# EAGLE schematic Water-Quality-IoT-RealTime-Sch (EAGLE 9.7.0)

## Sheet 1 of 2
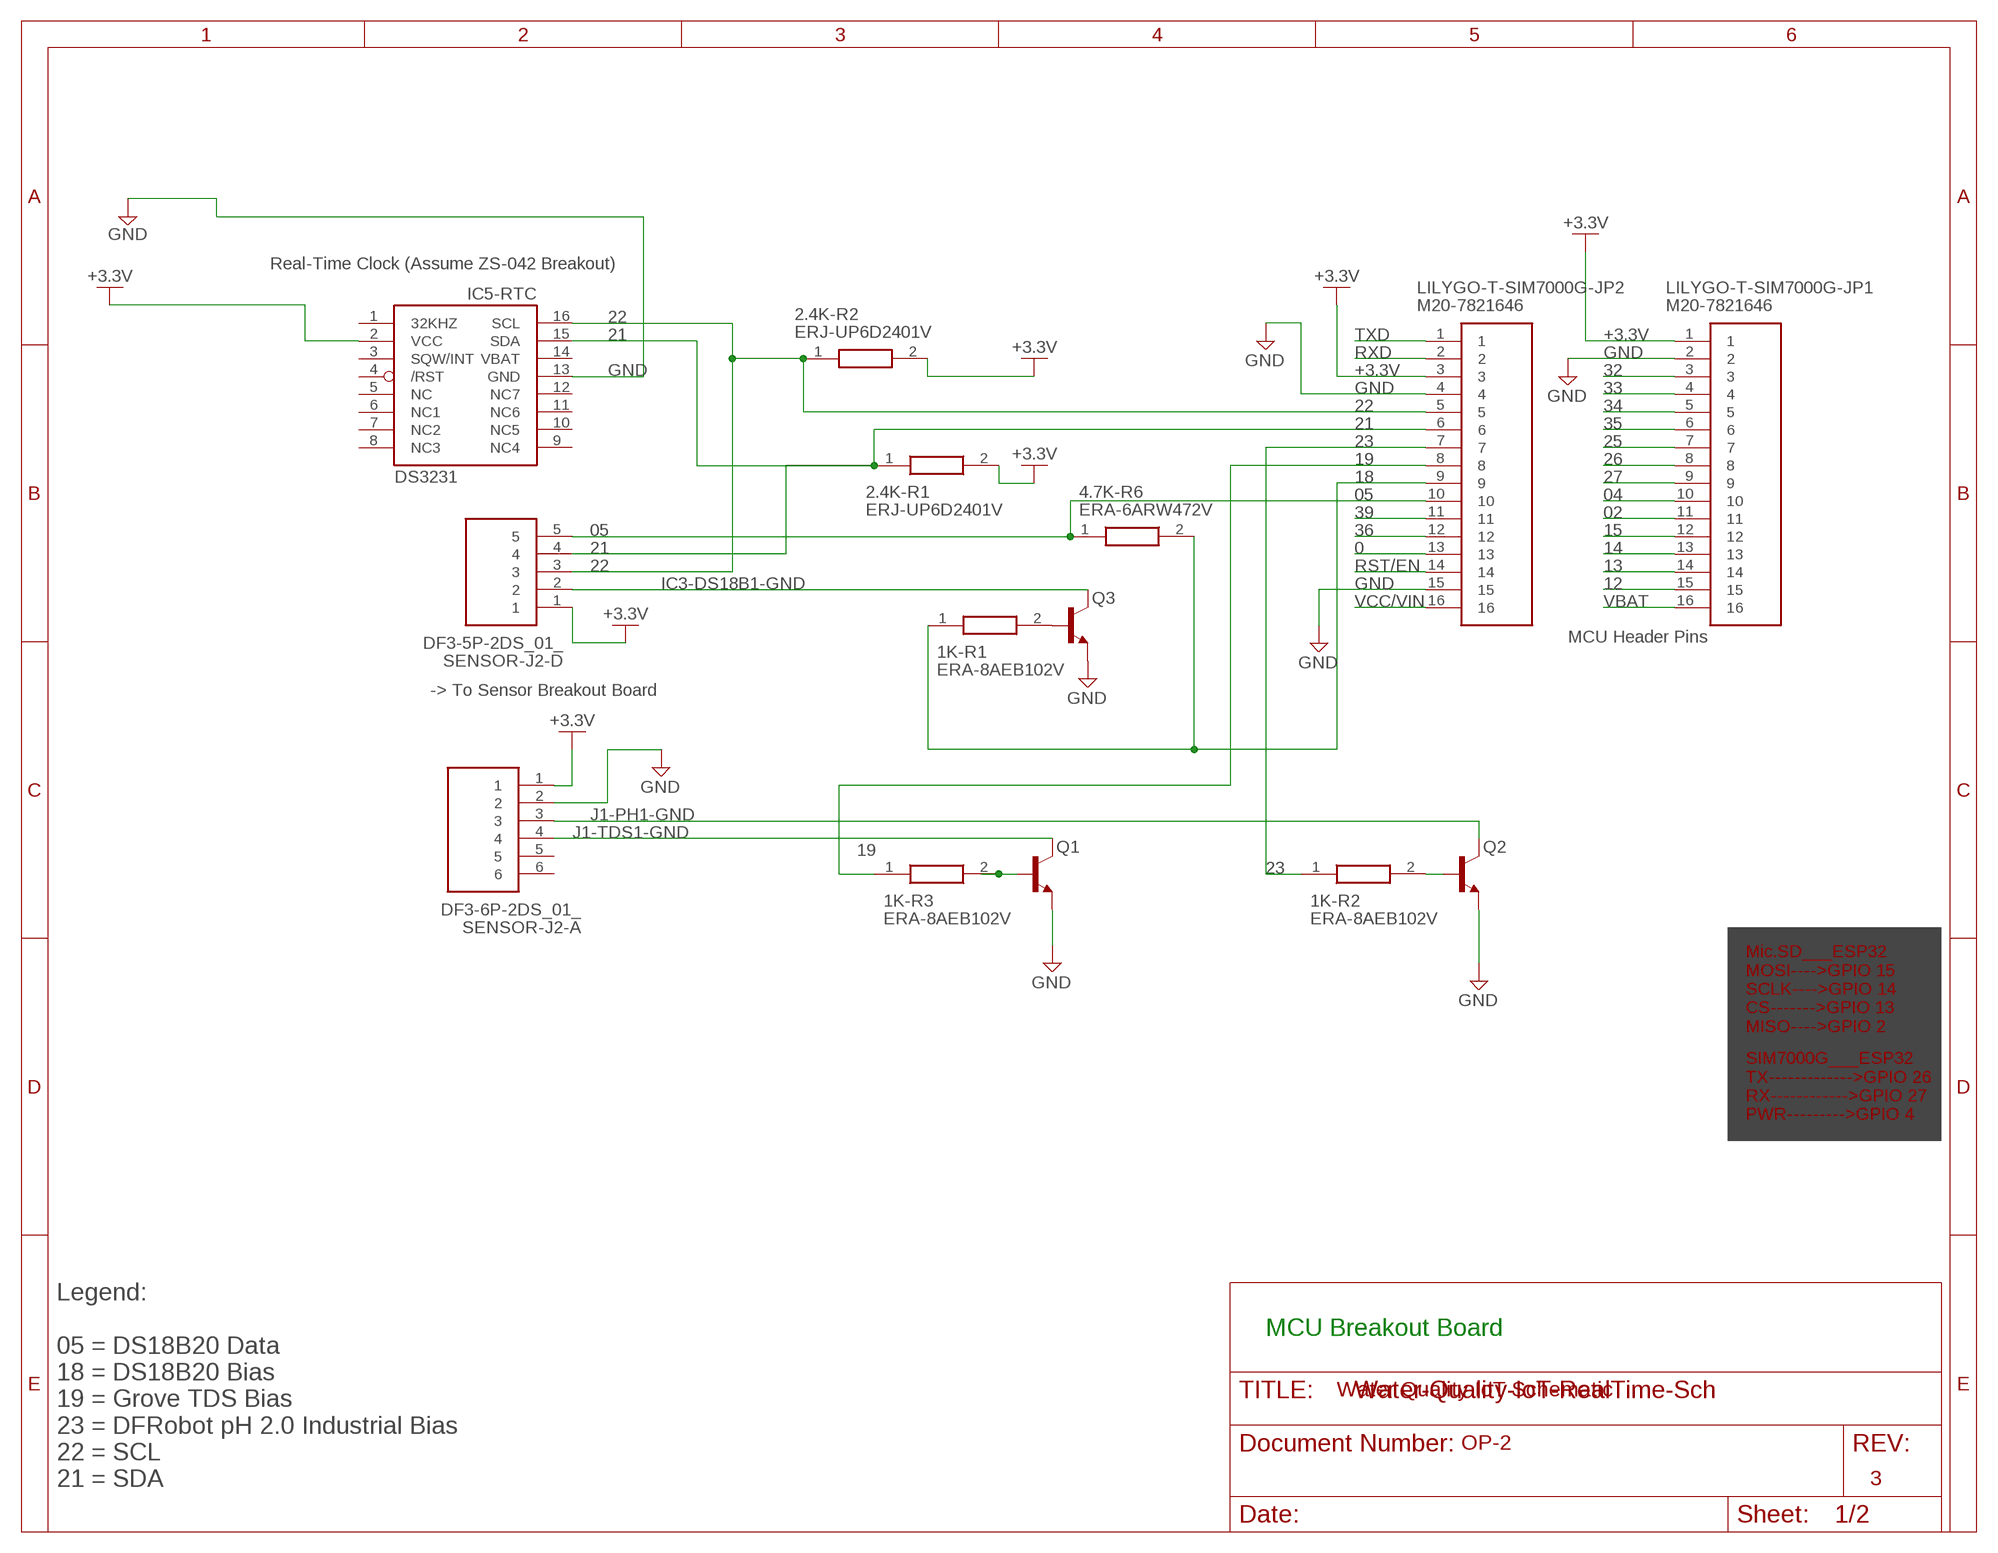
[diagram p0: schematic, sheet 1]

### Parts
1K-R1  ERA-8AEB102V  [RESC3216X70N]
1K-R2  ERA-8AEB102V  [RESC3216X70N]
1K-R3  ERA-8AEB102V  [RESC3216X70N]
2.4K-R1  ERJ-UP6D2401V  [ERJUP6]
2.4K-R2  ERJ-UP6D2401V  [ERJUP6]
4.7K-R6  ERA-6ARW472V  [ERA6AEB101V]
IC5-RTC  DS3231/SO  [SO16W]
LILYGO-T-SIM7000G-JP1  M20-7821646  [RHDR16W70P0X254_1X16_4104X250X]
LILYGO-T-SIM7000G-JP2  M20-7821646  [RHDR16W70P0X254_1X16_4104X250X]
Q1  BC547  NPN_BC547_TO92-CBE  [TO92]
Q2  BC547  NPN_BC547_TO92-CBE  [TO92]
Q3  BC547  NPN_BC547_TO92-CBE  [TO92]
SENSOR-J2-A  DF3-6P-2DS_01_  [DF36P2DS01]
SENSOR-J2-D  DF3-5P-2DS_01_  [SHDR5W60P0X200_1X5_1200X720X53]

### Nets
0: LILYGO-T-SIM7000G-JP2.13
02: LILYGO-T-SIM7000G-JP1.11
04: LILYGO-T-SIM7000G-JP1.10
05: 4.7K-R6.1 LILYGO-T-SIM7000G-JP2.10 SENSOR-J2-D.5 ; also sheet 2
12: LILYGO-T-SIM7000G-JP1.15
13: LILYGO-T-SIM7000G-JP1.14
14: LILYGO-T-SIM7000G-JP1.13
15: LILYGO-T-SIM7000G-JP1.12
18: 1K-R1.1 4.7K-R6.2 LILYGO-T-SIM7000G-JP2.9
19: 1K-R3.1 LILYGO-T-SIM7000G-JP2.8
21: 2.4K-R1.1 IC5-RTC.15(SDA) LILYGO-T-SIM7000G-JP2.6 SENSOR-J2-D.4 ; also sheet 2
22: 2.4K-R2.1 IC5-RTC.16(SCL) LILYGO-T-SIM7000G-JP2.5 SENSOR-J2-D.3 ; also sheet 2
23: 1K-R2.1 LILYGO-T-SIM7000G-JP2.7
25: LILYGO-T-SIM7000G-JP1.7
26: LILYGO-T-SIM7000G-JP1.8
27: LILYGO-T-SIM7000G-JP1.9
32: LILYGO-T-SIM7000G-JP1.3
33: LILYGO-T-SIM7000G-JP1.4
34: LILYGO-T-SIM7000G-JP1.5
35: LILYGO-T-SIM7000G-JP1.6
36: LILYGO-T-SIM7000G-JP2.12
39: LILYGO-T-SIM7000G-JP2.11
+3.3V: 2.4K-R1.2 2.4K-R2.2 LILYGO-T-SIM7000G-JP1.1 LILYGO-T-SIM7000G-JP2.3 SENSOR-J2-A.1 ; also sheet 2
GND: IC5-RTC.13(GND) LILYGO-T-SIM7000G-JP1.2 LILYGO-T-SIM7000G-JP2.4 LILYGO-T-SIM7000G-JP2.15 Q1.3(E) Q2.3(E) Q3.3(E) SENSOR-J2-A.2 ; also sheet 2
IC3-DS18B1-GND: Q3.1(C) SENSOR-J2-D.2 ; also sheet 2
J1-PH1-GND: Q2.1(C) SENSOR-J2-A.3 ; also sheet 2
J1-TDS1-GND: Q1.1(C) SENSOR-J2-A.4 ; also sheet 2
N$3: 1K-R3.2 Q1.2(B)
N$5: 1K-R2.2 Q2.2(B)
N$6: 1K-R1.2 Q3.2(B)
RST/EN: LILYGO-T-SIM7000G-JP2.14
RXD: LILYGO-T-SIM7000G-JP2.2
TXD: LILYGO-T-SIM7000G-JP2.1
VBAT: LILYGO-T-SIM7000G-JP1.16
VCC/VIN: IC5-RTC.2(VCC) LILYGO-T-SIM7000G-JP2.16 SENSOR-J2-D.1 ; supply symbol labelled +3.3V ; also sheet 2
Unconnected: IC5-RTC.1(32KHZ) IC5-RTC.3(SQW/INT) IC5-RTC.4(/RST) IC5-RTC.5(NC) IC5-RTC.6(NC1) IC5-RTC.7(NC2) IC5-RTC.8(NC3) IC5-RTC.9(NC4) IC5-RTC.10(NC5) IC5-RTC.11(NC6) IC5-RTC.12(NC7) SENSOR-J2-A.5 SENSOR-J2-A.6

### Notes on the sheet
- Real-Time Clock (Assume ZS-042 Breakout)
- MCU Header Pins
- -> To Sensor Breakout Board
- Mic.SD___ESP32
  MOSI---->GPIO 15
  SCLK---->GPIO 14
  CS------->GPIO 13
  MISO---->GPIO 2
- SIM7000G___ESP32
  TX------------->GPIO 26
  RX------------>GPIO 27
  PWR--------->GPIO 4
- MCU Breakout Board
- Water Quality IoT Schematic
- OP-2
- 3
- Legend:
  
  05 = DS18B20 Data
  18 = DS18B20 Bias
  19 = Grove TDS Bias
  23 = DFRobot pH 2.0 Industrial Bias
  22 = SCL
  21 = SDA

## Sheet 2 of 2
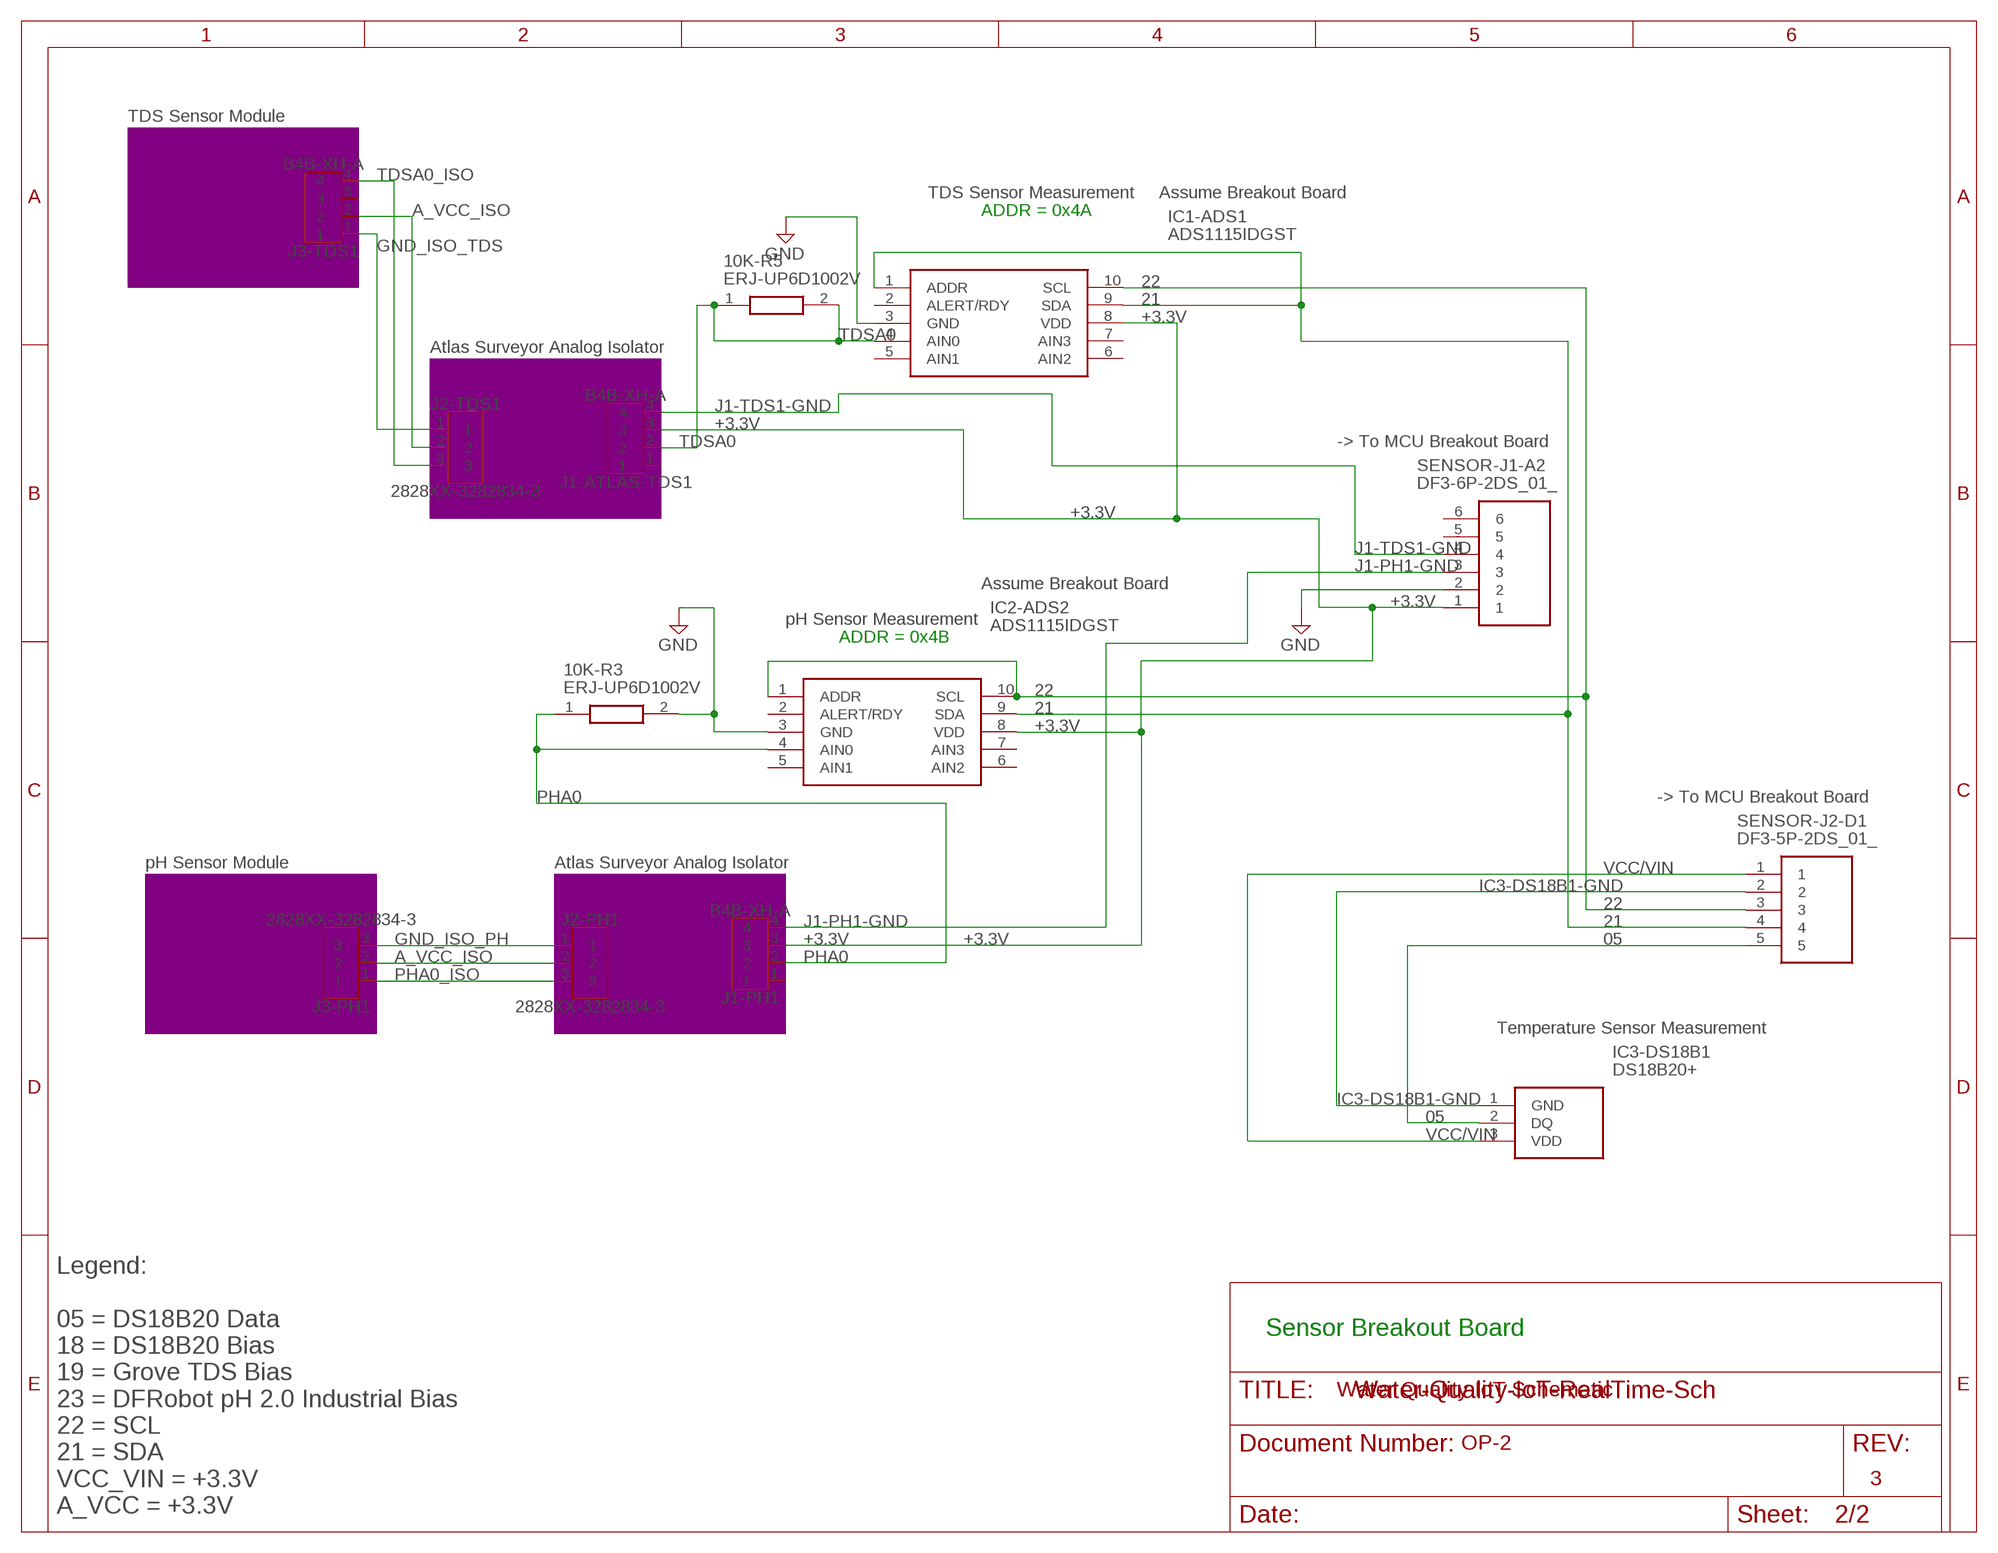
[diagram p1: schematic, sheet 2]

### Parts
10K-R3  ERJ-UP6D1002V  [ERJUP6]
10K-R5  ERJ-UP6D1002V  [ERJUP6]
IC1-ADS1  ADS1115IDGST  [SOP50P490X110-10N]
IC2-ADS2  ADS1115IDGST  [SOP50P490X110-10N]
IC3-DS18B1  DS18B20+  [DS18B20]
J1-ATLAS-TDS1  B4B-XH-A  [B4B-XH-A]
J1-PH1  B4B-XH-A  [B4B-XH-A]
J2-PH1  2828XX-3282834-3  [TERMBLK_254-3N]
J2-TDS1  2828XX-3282834-3  [TERMBLK_254-3N]
J3-PH1  2828XX-3282834-3  [TERMBLK_254-3N]
J3-TDS1  B4B-XH-A  [B4B-XH-A]
SENSOR-J1-A2  DF3-6P-2DS_01_  [DF36P2DS01]
SENSOR-J2-D1  DF3-5P-2DS_01_  [SHDR5W60P0X200_1X5_1200X720X53]

### Nets
05: IC3-DS18B1.2(DQ) SENSOR-J2-D1.5 ; also sheet 1
21: IC1-ADS1.1(ADDR) IC1-ADS1.9(SDA) IC2-ADS2.9(SDA) SENSOR-J2-D1.4 ; also sheet 1
22: IC1-ADS1.10(SCL) IC2-ADS2.1(ADDR) IC2-ADS2.10(SCL) SENSOR-J2-D1.3 ; also sheet 1
+3.3V: IC1-ADS1.8(VDD) IC2-ADS2.8(VDD) J1-ATLAS-TDS1.3 J1-PH1.3 SENSOR-J1-A2.1 ; also sheet 1
A_VCC_ISO: J2-PH1.2 J2-TDS1.2 J3-PH1.2 J3-TDS1.2
GND: 10K-R3.2 IC1-ADS1.3(GND) IC2-ADS2.3(GND) SENSOR-J1-A2.2 ; also sheet 1
GND_ISO_PH: J2-PH1.1 J3-PH1.3
GND_ISO_TDS: J2-TDS1.1 J3-TDS1.1
IC3-DS18B1-GND: IC3-DS18B1.1(GND) SENSOR-J2-D1.2 ; also sheet 1
J1-PH1-GND: J1-PH1.4 SENSOR-J1-A2.3 ; also sheet 1
J1-TDS1-GND: J1-ATLAS-TDS1.4 SENSOR-J1-A2.4 ; also sheet 1
PHA0: 10K-R3.1 IC2-ADS2.4(AIN0) J1-PH1.2
PHA0_ISO: J2-PH1.3 J3-PH1.1
TDSA0: 10K-R5.1 10K-R5.2 IC1-ADS1.4(AIN0) J1-ATLAS-TDS1.2
TDSA0_ISO: J2-TDS1.3 J3-TDS1.4
VCC/VIN: IC3-DS18B1.3(VDD) SENSOR-J2-D1.1 ; also sheet 1
Unconnected: IC1-ADS1.2(ALERT/RDY) IC1-ADS1.5(AIN1) IC1-ADS1.6(AIN2) IC1-ADS1.7(AIN3) IC2-ADS2.2(ALERT/RDY) IC2-ADS2.5(AIN1) IC2-ADS2.6(AIN2) IC2-ADS2.7(AIN3) J1-ATLAS-TDS1.1 J1-PH1.1 J3-TDS1.3 SENSOR-J1-A2.5 SENSOR-J1-A2.6

### Notes on the sheet
- TDS Sensor Module
- TDS Sensor Measurement | Assume Breakout Board
- ADDR = 0x4A
- Atlas Surveyor Analog Isolator
- -> To MCU Breakout Board
- Assume Breakout Board
- pH Sensor Measurement
- ADDR = 0x4B
- -> To MCU Breakout Board
- pH Sensor Module | Atlas Surveyor Analog Isolator
- Temperature Sensor Measurement
- Sensor Breakout Board
- Water Quality IoT Schematic
- OP-2
- 3
- Legend:
  
  05 = DS18B20 Data
  18 = DS18B20 Bias
  19 = Grove TDS Bias
  23 = DFRobot pH 2.0 Industrial Bias
  22 = SCL
  21 = SDA
  VCC_VIN = +3.3V
  A_VCC = +3.3V

## Power pins joined to a net without a drawn wire
VBAT: IC5-RTC.14(VBAT)

## Library data of the parts
1K-R1-1K-R3 = SamacSys_Parts:ERA-8AEB102V: Thin Film Resistors - SMD 1206 1.0Kohm 0.1% 25ppm Source: Datasheet <https://industrial.panasonic.com/cdbs/www-data/pdf/RDM0000/AOA0000C307.pdf>; DESCRIPTION: Thin Film Resistors - SMD 1206 1.0Kohm 0.1% 25ppm; HEIGHT: 0.7mm; MANUFACTURER_NAME: Panasonic; MANUFACTURER_PART_NUMBER: ERA-8AEB102V; MOUSER_PART_NUMBER: 667-ERA-8AEB102V; MOUSER_PRICE-STOCK: https://www.mouser.co.uk/ProductDetail/Panasonic/ERA-8AEB102V?qs=Ojoo2rCVP9R3RwZw0XjknA%3D%3D
2.4K-R1 2.4K-R2 = SamacSys_Parts:ERJ-UP6D2401V: Anti-Sulfurated Thick Film Chip Resistors/ Anti-Surge Type, Power Rating (W): 0.5, Chip Size (LxW(EIA)) (mm): 2.0 x 1.25 (EIA:0805), Resistance Values (?): 2400, Resistance Tolerance (%): 0.5, T.C.R (?102/K): ?100 Source: Datasheet <https://industrial.panasonic.com/cdbs/www-data/pdf/RDP0000/AOA0000C337.pdf>; DESCRIPTION: Anti-Sulfurated Thick Film Chip Resistors/ Anti-Surge Type, Power Rating (W): 0.5, Chip Size (LxW(EIA)) (mm): 2.0 x 1.25 (EIA:0805), Resistance Values (?): 2400, Resistance Tolerance (%): 0.5, T.C.R (?102/K): ?100; HEIGHT: 0.7mm; MANUFACTURER_NAME: Panasonic; MANUFACTURER_PART_NUMBER: ERJ-UP6D2401V
4.7K-R6 = SamacSys_Parts:ERA-6ARW472V: Thin Film Resistors - SMD 0805 4.7Kohm 0.05% 10ppm AEC-Q200 Source: Datasheet <https://industrial.panasonic.com/cdbs/www-data/pdf/RDM0000/AOA0000C307.pdf>; DESCRIPTION: Thin Film Resistors - SMD 0805 4.7Kohm 0.05% 10ppm AEC-Q200; HEIGHT: 0.6mm; MANUFACTURER_NAME: Panasonic; MANUFACTURER_PART_NUMBER: ERA-6ARW472V; MOUSER_PART_NUMBER: 667-ERA-6ARW472V; MOUSER_PRICE-STOCK: https://www.mouser.co.uk/ProductDetail/Panasonic/ERA-6ARW472V?qs=ob%252BdNz2%252BYEgbYp9qzrbNPA%3D%3D
10K-R3 10K-R5 = SamacSys_Parts:ERJ-UP6D1002V: Anti-Sulfurated Thick Film Chip Resistors/ Anti-Surge Type, Power Rating (W): 0.5, Chip Size (LxW(EIA)) (mm): 2.0 x 1.25 (EIA:0805), Resistance Values (?): 10000, Resistance Tolerance (%): 0.5, T.C.R (?102/K): ?100 Source: Datasheet <https://industrial.panasonic.com/cdbs/www-data/pdf/RDP0000/AOA0000C337.pdf>; DESCRIPTION: Anti-Sulfurated Thick Film Chip Resistors/ Anti-Surge Type, Power Rating (W): 0.5, Chip Size (LxW(EIA)) (mm): 2.0 x 1.25 (EIA:0805), Resistance Values (?): 10000, Resistance Tolerance (%): 0.5, T.C.R (?102/K): ?100; HEIGHT: 0.7mm; MANUFACTURER_NAME: Panasonic; MANUFACTURER_PART_NUMBER: ERJ-UP6D1002V
IC1-ADS1 IC2-ADS2 = SamacSys_Parts:ADS1115IDGST: 16-Bit, 860SPS, 4-Ch Delta-Sigma ADC w/ PGA, Oscillator, Voltage Reference, Comparator & I2C Source: Datasheet <https://datasheet.datasheetarchive.com/originals/distributors/Datasheets-SFU2/DSASFU100025989.pdf>; DESCRIPTION: 16-Bit, 860SPS, 4-Ch Delta-Sigma ADC w/ PGA, Oscillator, Voltage Reference, Comparator & I2C; HEIGHT: 1.1mm; MANUFACTURER_NAME: Texas Instruments; MANUFACTURER_PART_NUMBER: ADS1115IDGST; MOUSER_PART_NUMBER: 595-ADS1115IDGST; MOUSER_PRICE-STOCK: https://www.mouser.co.uk/ProductDetail/Texas-Instruments/ADS1115IDGST?qs=6805eV47HhY3JIwOhQ2zog%3D%3D
IC3-DS18B1 = SamacSys_Parts:DS18B20+: Board Mount Temperature Sensors Programmable Resolution 1-Wire Digital Thermometer Source: Datasheet <https://ms.componentsearchengine.com/Datasheets/2/DS18B20 .pdf>; ARROW_PART_NUMBER: DS18B20+; ARROW_PRICE-STOCK: https://www.arrow.com/en/products/ds18b20/analog-devices?utm_currency=USD&region=nac; DESCRIPTION: Board Mount Temperature Sensors Programmable Resolution 1-Wire Digital Thermometer; HEIGHT: 4.95mm; MANUFACTURER_NAME: Analog Devices; MANUFACTURER_PART_NUMBER: DS18B20+
IC5-RTC = adafruit:DS3231
J1-ATLAS-TDS1 J1-PH1 J3-TDS1 = Connector:B4B-XH-A: XH Connector Top Entry - 4POS Details see: Datasheet <http://www.jst-mfg.com/product/pdf/eng/eXH.pdf>; CATEGORY: Header; DATASHEET: https://www.jst-mfg.com/product/pdf/eng/eXH.pdf?67404de0bbae1; DESCRIPTION: Connector Header Through Hole 4 position 0.098" (2.50mm); MANUFACTURER: JST Sales America Inc.; MPN: B4B-XH-A; OPERATING_TEMPERATURE: -25°C ~ 85°C; PACKAGE_SIZE: NA; PACKAGE_TYPE: THT; PART_STATUS: ACTIVE; PITCH: 0.098" (2.50mm); ROHS: COMPLIANT; SERIES: XH; SUBCATEGORY: Rectangular Connectors; TYPE: Header-Male Pin-Board to Cable/Wire-Through Hole
J2-PH1 J2-TDS1 J3-PH1 = Connector:2828XX-3: 3 Position Wire to Board Terminal Block Horizontal with Board Datasheet <https://www.te.com.cn/commerce/DocumentDelivery/DDEController?Action=showdoc&DocId=Catalog+Section%7F1308389_EUROSTYLE_TERMINAL_BLOCKS%7F0607%7Fpdf%7FEnglish%7FENG_CS_1308389_EUROSTYLE_TERMINAL_BLOCKS_0607.pdf%7F2-282837-5>; CATEGORY: Fixed Terminal Blocks; DATASHEET: https://www.te.com/usa-en/product-282834-3.datasheet.pdf; DESCRIPTION: 3 Position Wire to Board Terminal Block Horizontal with Board 0.100" (2.54mm) Through Hole; MANUFACTURER: TE Connectivity AMP Connectors; MPN: 282834-3; OPERATING_TEMPERATURE: -40°C ~ 105°C; PACKAGE_SIZE: NA; PACKAGE_TYPE: THT; PART_STATUS: ACTIVE; PITCH: 0.100" (2.54mm); ROHS: COMPLIANT; SERIES: Buchanan; SUBCATEGORY: Terminal Blocks; TYPE: Through Hole Screw - Rising Cage Clamp Side wire entry Horizontal with Board
LILYGO-T-SIM7000G-JP1 LILYGO-T-SIM7000G-JP2 = SamacSys_Parts:M20-7821646: 2.54mm (0.1") Pitch SIL Vertical Throughboard Socket Assembly, tin, 16 contacts Source: Datasheet <https://cdn.harwin.com/pdfs/M20-782.pdf>; DESCRIPTION: 2.54mm (0.1") Pitch SIL Vertical Throughboard Socket Assembly, tin, 16 contacts; HEIGHT: 8.65mm; MANUFACTURER_NAME: Harwin; MANUFACTURER_PART_NUMBER: M20-7821646; MOUSER_PART_NUMBER: 855-M20-7821646; MOUSER_PRICE-STOCK: https://www.mouser.co.uk/ProductDetail/Harwin/M20-7821646?qs=ulE8k0yEMYY%2FiqJJrYG%252B4w%3D%3D
Q1-Q3 = Transistor:NPN_: NPN Transistor - Popular parts; CATEGORY: Transistor; DATASHEET: https://mm.digikey.com/Volume0/opasdata/d220001/medias/docus/944/BC546-50.pdf; DESCRIPTION: Bipolar (BJT) Transistor NPN 45 V 100 mA 300MHz 500 mW Through Hole TO-92-3; DRAIN_CURRENT: NA; IC_MAX: 100 mA; MANUFACTURER: Onsemi; MPN: BC547; OPERATING_TEMPERATURE: -65°C ~ 150°C; PACKAGE_SIZE: TO-92; PACKAGE_TYPE: THT; PART_STATUS: OBSOLETE; ROHS: COMPLIANT; SERIES: BC547; SUBCATEGORY: BJT; THERMALLOSS: 0.5 W; TYPE: NPN; VCEO_MAX: 45 V
SENSOR-J1-A2 SENSOR-J2-A = SamacSys_Parts:DF3-6P-2DS_01_: Hirose DF3 Series, 2mm Pitch 6 Way 1 Row Right Angle PCB Header, Solder Termination, 3A Source: Datasheet <https://datasheet.datasheetarchive.com/originals/distributors/Datasheets-DGA21/2083132.pdf>; DESCRIPTION: Hirose DF3 Series, 2mm Pitch 6 Way 1 Row Right Angle PCB Header, Solder Termination, 3A; HEIGHT: 5.3mm; MANUFACTURER_NAME: Hirose; MANUFACTURER_PART_NUMBER: DF3-6P-2DS(01); MOUSER_PART_NUMBER: 798-DF3-6P-2DS01; MOUSER_PRICE-STOCK: https://www.mouser.co.uk/ProductDetail/Hirose-Connector/DF3-6P-2DS01?qs=zOgoZG1CgI%252B7wdD76MGdiQ%3D%3D
SENSOR-J2-D SENSOR-J2-D1 = SamacSys_Parts:DF3-5P-2DS_01_: CONN HEADER 5POS 2MM R/A GOLD Source: Datasheet <https://www.hirose.com/product/document?clcode=CL0543-0034-1-01&productname=DF3-5P-2DS(01)&series=DF3&documenttype=2DDrawing&lang=en&documentid=0000995371>; ARROW_PART_NUMBER: DF3-5P-2DS(01); ARROW_PRICE-STOCK: https://www.arrow.com/en/products/df3-5p-2ds-01/hirose-electric; DESCRIPTION: CONN HEADER 5POS 2MM R/A GOLD; HEIGHT: 5.3mm; MANUFACTURER_NAME: Hirose; MANUFACTURER_PART_NUMBER: DF3-5P-2DS(01)